# Altium schematic sheet 6V Boost - High Current.SchDoc
size 431 x 279 mm
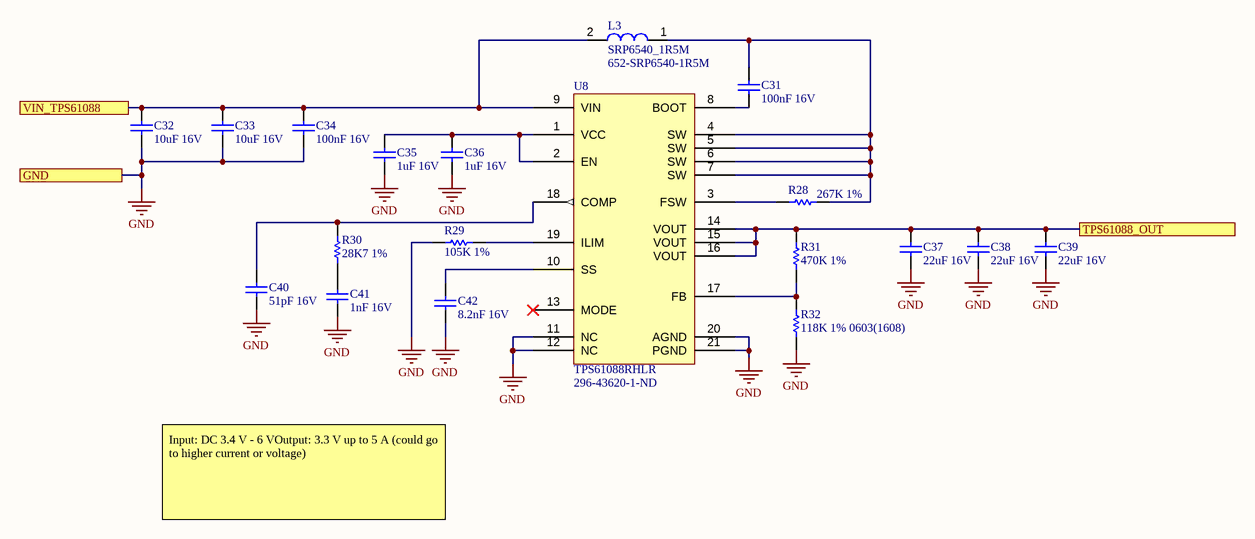
[diagram p0: 6V Boost - High Current.SchDoc]

## Parts
C31  100nF 16V  [CAPC0603(1608)100_N]
C32  10uF 16V  [CAPC0805(2012)145_N]
C33  10uF 16V  [CAPC0805(2012)145_N]
C34  100nF 16V  [CAPC0603(1608)100_N]
C35  1uF 16V  [CAPC0603(1608)100_N]
C36  1uF 16V  [CAPC0603(1608)100_N]
C37  22uF 16V  [CAPC2220(5750)300_N]
C38  22uF 16V  [CAPC2220(5750)300_N]
C39  22uF 16V  [CAPC2220(5750)300_N]
C40  51pF 16V  [CAPC0603(1608)100_L]
C41  1nF 16V  [CAPC0603(1608)100_L]
C42  8.2nF 16V  [CAPC0603(1608)100_M]
L3  SRP6540_1R5M  Supplier Part Number 1: 652-SRP6540-1R5M  [SRP6540_1R5M]
R28  267K 1%  [RESC0603(1608)_L]
R29  105K 1%  [RESC0603(1608)_L]
R30  28K7 1%  [RESC0603(1608)_L]
R31  470K 1%  [RESC0603(1608)_L]
R32  118K 1% 0603(1608)  [RESC0603(1608)_M]
U8  TPS61088RHLR  Supplier Part Number 1: 296-43620-1-ND  [QFN50P450X350X100_HS-21N]

## Ports
GND, TPS61088_OUT, VIN_TPS61088

## Nets
GND: C32.1 C33.1 C34.1 C35.1 C36.1 C37.2 C38.2 C39.2 C40.1 C41.1 C42.1 R29.1 R32.1 U8.11(NC) U8.12(NC) U8.20(AGND) U8.21(PGND) ; port GND
TPS61088_OUT: C37.1 C38.1 C39.1 R31.2 U8.14(VOUT) U8.15(VOUT) U8.16(VOUT) ; port TPS61088_OUT
VIN_TPS61088: C32.2 C33.2 C34.2 L3.2 U8.9(VIN) ; port VIN_TPS61088
NetC31_1: C31.1 U8.8(BOOT)
NetC31_2: C31.2 L3.1 R28.1 U8.4(SW) U8.5(SW) U8.6(SW) U8.7(SW)
NetC35_2: C35.2 C36.2 U8.1(VCC) U8.2(EN)
NetC40_2: C40.2 R30.2 U8.18(COMP)
NetC41_2: C41.2 R30.1
NetC42_2: C42.2 U8.10(SS)
NetR28_2: R28.2 U8.3(FSW)
NetR29_2: R29.2 U8.19(ILIM)
NetR31_1: R31.1 R32.2 U8.17(FB)

Not connected (* = marked no-connect by the designer): U8 13(MODE)*

## Notes on the sheet
- Input: DC 3.4 V - 6 VOutput: 3.3 V up to 5 A (could go to higher current or voltage)
- DWG. NO.
- REV.
- SHT.
- THIS DOCUMENT AND THE DATA DISCLOSED HEREIN OR HEREWITH IS THE PROPERTY OF ALTIUM LIMITED AND MAY BE FREELY DISTRIBUTED IN WHOLE. NO RIGHTS ARE RESERVED OR EXPRESS OR IMPLIED WARANTEE GIVEN.
- REVISION
- DESCRIPTION
- DATE
- APPROVED
- ENG:
- APPROVALS
- PROJECT
- DSN:
- CHK:
- REFERENCE DOCUMENTS
- PROJECT REVISION:
- TITLE
- DOCUMENT REVISION:
- DESIGN ITEM:
- BOM:
- FAB DWG:
- PCB DWG:
- ASSY DWG:
- SCALE:
- SIZE
- B
- CAGE CODE
- FILE NAME
- DWG NO.
- SHEET
- OF
- REV

## Library data of the parts
C31 C34 = CMP-1035-02584-1: CAP 100nF 16V ±10% 0603 (1608 Metric) Thickness 1mm SMD; Tolerance: Â±10%; Case-EIA: 0603; Case-Metric: 1608; Technology: SMT; Max Thickness: 1 mm; Value: 100nF; Rated Voltage: 16 V
C32 C33 = CMP-1036-04927-1: CAP 10uF 16V ±10% 0805 (2012 Metric) Thickness 1.45mm SMD; Case-EIA: 0805; Tolerance: Â±10%; Case-Metric: 2012; Rated Voltage: 16 V; Technology: SMT; Value: 10uF; Max Thickness: 1.45 mm
C35 C36 = CMP-1035-02736-1: CAP 1uF 16V ±5% 0603 (1608 Metric) Thickness 1mm SMD; Case-Metric: 1608; Case-EIA: 0603; Tolerance: Â±5%; Technology: SMT; Max Thickness: 1 mm; Rated Voltage: 16 V; Value: 1uF
C37-C39 = CMP-1042-00776-1: CAP 22uF 16V ±20% 2220 (5750 Metric) Thickness 3mm SMD; Case-Metric: 5750; Case-EIA: 2220; Tolerance: Â±20%; Max Thickness: 3 mm; Value: 22uF; Rated Voltage: 16 V; Technology: SMT
C40 = CMP-1035-01085-1: CAP 51pF 16V ±5% 0603 (1608 Metric) Thickness 1mm SMD; Tolerance: Â±5%; Case-EIA: 0603; Case-Metric: 1608; Rated Voltage: 16 V; Value: 51pF; Technology: SMT; Max Thickness: 1 mm
C41 = CMP-1035-01876-1: CAP 1nF 16V ±1% 0603 (1608 Metric) Thickness 1mm SMD; Case-EIA: 0603; Case-Metric: 1608; Tolerance: Â±1%; Value: 1nF; Technology: SMT; Rated Voltage: 16 V; Max Thickness: 1 mm
C42 = CMP-1035-02284-1: CAP 8.2nF 16V ±5% 0603 (1608 Metric) Thickness 1mm SMD; Case-Metric: 1608; Tolerance: Â±5%; Case-EIA: 0603; Rated Voltage: 16 V; Max Thickness: 1 mm; Value: 8.2nF; Technology: SMT
L3 = CMP-00369-1: 1.5µH Shielded Wirewound Inductor 11A 10 mOhm Max Nonstandard; Manufacturer: Bourns; Manufacturer Part Number: SRP6540-1R5M; SVHC: No SVHC (16-Dec-2013); Product Range: BOURNS - SRP6540 Series; Inductance Tolerance: ± 20%; DC Resistance Max: 0.01ohm; Supplier 1: Mouser; Stock 1: 1156; Pricing 1: 1=1.18, 10=1.04, 50=0.888, 100=0.843, 1000=0.68, 10000=0.492 (USD); Saturation Current (Isat): 11A; Case Dimensions: 7.2mm x 6.5mm x 4mm; Inductance: 1.5µH; Inductor Construction: Shielded; RMS Current (Irms): 11A; Packaging: Each; ComponentLink1URL: https://datasheet.ciiva.com/15027/srp6540-15027285.pdf; ComponentLink1Description: https://datasheet.ciiva.com/15027/srp6540-15027285.pdf; ComponentLink2URL: https://datasheet.ciiva.com/15027/srp6540-15027286.pdf; ComponentLink2Description: https://datasheet.ciiva.com/15027/srp6540-15027286.pdf; ComponentLink3URL: https://datasheet.ciiva.com/15027/srp6540-15027287.pdf; ComponentLink3Description: https://datasheet.ciiva.com/15027/srp6540-15027287.pdf; ComponentLink4URL: https://datasheet.ciiva.com/22667/1698468-22667146.pdf; ComponentLink4Description: https://datasheet.ciiva.com/22667/1698468-22667146.pdf; ComponentLink5URL: https://datasheet.ciiva.com/17000/70281705-17000734.pdf; ComponentLink5Description: https://datasheet.ciiva.com/17000/70281705-17000734.pdf; ComponentLink6URL: https://datasheet.ciiva.com/28679/1698468-28679550.pdf; ComponentLink6Description: https://datasheet.ciiva.com/28679/1698468-28679550.pdf; SchLibComponentName: SRP6540_1R5M
R28 = CMP-1012-00782-1: 267K 0.1W 1% 0603 (1608 Metric)  SMD; Case-Metric: 1608; Case-EIA: 0603; Value: 267000.00 Ohm; Tolerance: 1 %; Technology: SMT; Power: 0.1 W
R29 = CMP-1012-00738-1: 105K 0.1W 1% 0603 (1608 Metric)  SMD; Value: 105000.00 Ohm; Case-Metric: 1608; Case-EIA: 0603; Tolerance: 1 %; Technology: SMT; Power: 0.1 W
R30 = CMP-1012-00673-1: 28K7 0.1W 1% 0603 (1608 Metric)  SMD; Case-EIA: 0603; Case-Metric: 1608; Value: 28700.00 Ohm; Tolerance: 1 %; Power: 0.1 W; Technology: SMT
R31 = CMP-1012-00812-1: 470K 0.1W 1% 0603 (1608 Metric)  SMD; Value: 470000.00 Ohm; Case-EIA: 0603; Case-Metric: 1608; Power: 0.1 W; Tolerance: 1 %; Technology: SMT
R32 = CMP-1012-00743-1: 118K 0.1W 1% 0603 (1608 Metric)  SMD; Case-Metric: 1608; Case-EIA: 0603; Value: 118000.00 Ohm; Technology: SMT; Power: 0.1 W; Tolerance: 1 %
U8 = CMP-00368-3: Manufacturer: Texas Instruments; Function: Step-Up; Output Configuration: Positive; Topology: Boost; Output Type: Adjustable; Number of Outputs: 1; Voltage - Input (Min): 2.7V; Voltage - Input (Max): 12V; Voltage - Output (Min/Fixed): 4.5V; Voltage - Output (Max): 12.6V; Current - Output: 10A; Frequency - Switching: 200kHz ~ 2.2MHz; Synchronous Rectifier: Yes; SchLibComponentName: Component_1; Supplier 1: Digi-Key; Manufacturer Part Number: TPS61088RHLR; RoHS: RoHS Compliant; Category: Integrated Circuits (ICs); Stock 1: 3052; Pricing 1: 1=3.93, 10=3.53, 100=2.8922, 500=2.46212, 1000=2.07648 (USD); Packaging: Cut Tape (CT); Part Status: Active; Operating Temperature: -40°C ~ 85°C (TA); Mounting Type: Surface Mount; Package / Case: 20-VFQFN Exposed Pad; Supplier Device Package: 20-VQFN (3.5x4.5); ComponentLink1URL: http://www.ti.com/lit/ds/symlink/tps61088.pdf; ComponentLink1Description: http://www.ti.com/lit/ds/symlink/tps61088.pdf